# Altium schematic sheet EtherCAT.SchDoc
size A4
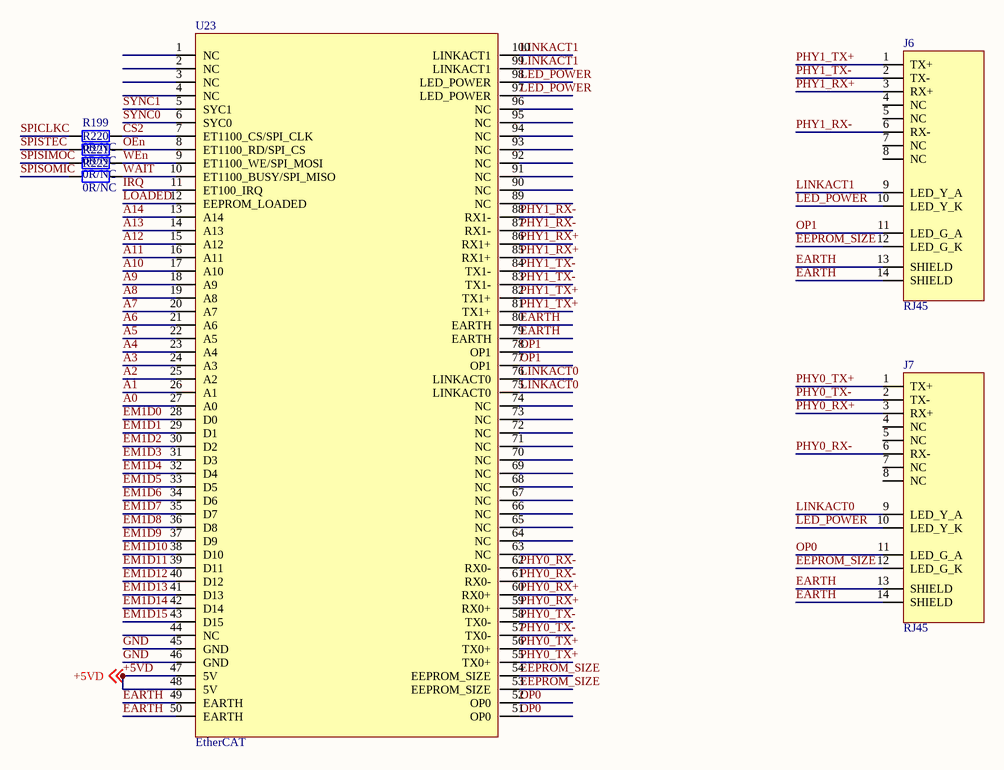
[diagram p0: EtherCAT.SchDoc]

## Parts
J6  RJ45  [RJ45]
J7  RJ45  [RJ45]
R199  0R/NC  [0603R]
R220  0R/NC  [0603R]
R221  0R/NC  [0603R]
R222  0R/NC  [0603R]
U23  EtherCAT  [EtherCAT]

## Nets
+5VD: U23.47(5V) U23.48(5V) ; off-sheet +5VD
A0: U23.27(A0)
A1: U23.26(A1)
A2: U23.25(A2)
A3: U23.24(A3)
A4: U23.23(A4)
A5: U23.22(A5)
A6: U23.21(A6)
A7: U23.20(A7)
A8: U23.19(A8)
A9: U23.18(A9)
A10: U23.17(A10)
A11: U23.16(A11)
A12: U23.15(A12)
A13: U23.14(A13)
A14: U23.13(A14)
CS2: R199.1 U23.7(ET1100_CS/SPI_CLK)
EARTH: J6.13(SHIELD) J6.14(SHIELD) J7.13(SHIELD) J7.14(SHIELD) U23.49(EARTH) U23.50(EARTH) U23.79(EARTH) U23.80(EARTH)
EEPROM_SIZE: J6.12(LED_G_K) J7.12(LED_G_K) U23.53(EEPROM_SIZE) U23.54(EEPROM_SIZE)
EM1D0: U23.28(D0)
EM1D1: U23.29(D1)
EM1D2: U23.30(D2)
EM1D3: U23.31(D3)
EM1D4: U23.32(D4)
EM1D5: U23.33(D5)
EM1D6: U23.34(D6)
EM1D7: U23.35(D7)
EM1D8: U23.36(D8)
EM1D9: U23.37(D9)
EM1D10: U23.38(D10)
EM1D11: U23.39(D11)
EM1D12: U23.40(D12)
EM1D13: U23.41(D13)
EM1D14: U23.42(D14)
EM1D15: U23.43(D15)
GND: U23.45(GND) U23.46(GND)
IRQ: U23.11(ET100_IRQ)
LED_POWER: J6.10(LED_Y_K) J7.10(LED_Y_K) U23.97(LED_POWER) U23.98(LED_POWER)
LINKACT0: J7.9(LED_Y_A) U23.75(LINKACT0) U23.76(LINKACT0)
LINKACT1: J6.9(LED_Y_A) U23.99(LINKACT1) U23.100(LINKACT1)
LOADED: U23.12(EEPROM_LOADED)
OEn: R220.1 U23.8(ET1100_RD/SPI_CS)
OP0: J7.11(LED_G_A) U23.51(OP0) U23.52(OP0)
OP1: J6.11(LED_G_A) U23.77(OP1) U23.78(OP1)
PHY0_RX+: J7.3(RX+) U23.59(RX0+) U23.60(RX0+)
PHY0_RX-: J7.6(RX-) U23.61(RX0-) U23.62(RX0-)
PHY0_TX+: J7.1(TX+) U23.55(TX0+) U23.56(TX0+)
PHY0_TX-: J7.2(TX-) U23.57(TX0-) U23.58(TX0-)
PHY1_RX+: J6.3(RX+) U23.85(RX1+) U23.86(RX1+)
PHY1_RX-: J6.6(RX-) U23.87(RX1-) U23.88(RX1-)
PHY1_TX+: J6.1(TX+) U23.81(TX1+) U23.82(TX1+)
PHY1_TX-: J6.2(TX-) U23.83(TX1-) U23.84(TX1-)
SPICLKC: R199.2
SPISIMOC: R221.2
SPISOMIC: R222.2
SPISTEC: R220.2
SYNC0: U23.6(SYC0)
SYNC1: U23.5(SYC1)
WAIT: R222.1 U23.10(ET1100_BUSY/SPI_MISO)
WEn: R221.1 U23.9(ET1100_WE/SPI_MOSI)

Not connected (* = marked no-connect by the designer): J6 4(NC) 5(NC) 7(NC) 8(NC); J7 4(NC) 5(NC) 7(NC) 8(NC); U23 1(NC) 2(NC) 3(NC) 4(NC) 44(NC) 63(NC) 64(NC) 65(NC) 66(NC) 67(NC) 68(NC) 69(NC) 70(NC) 71(NC) 72(NC) 73(NC) 74(NC) 89(NC) 90(NC) 91(NC) 92(NC) 93(NC) 94(NC) 95(NC) 96(NC)

## Library data of the parts
R199 R220-R222 = Res2: Resistor; Value: 1K; Published: 8-Jun-2000; LatestRevisionDate: 17-Jul-2002; LatestRevisionNote: Re-released for DXP Platform.; PackageReference: AXIAL-0.4; Publisher: Altium Limited
U23 = EtherCAT_MOD